# Altium schematic sheet PRINCIPAL.SchDoc: SENSACIONAL 2 - PRINCIPAL
size A3; ApprovedBy: ---; Author: MARIO DE MIGUEL; SheetNumber: 1; SheetTotal: 7; ProjectTitle: SENSACIONAL 2
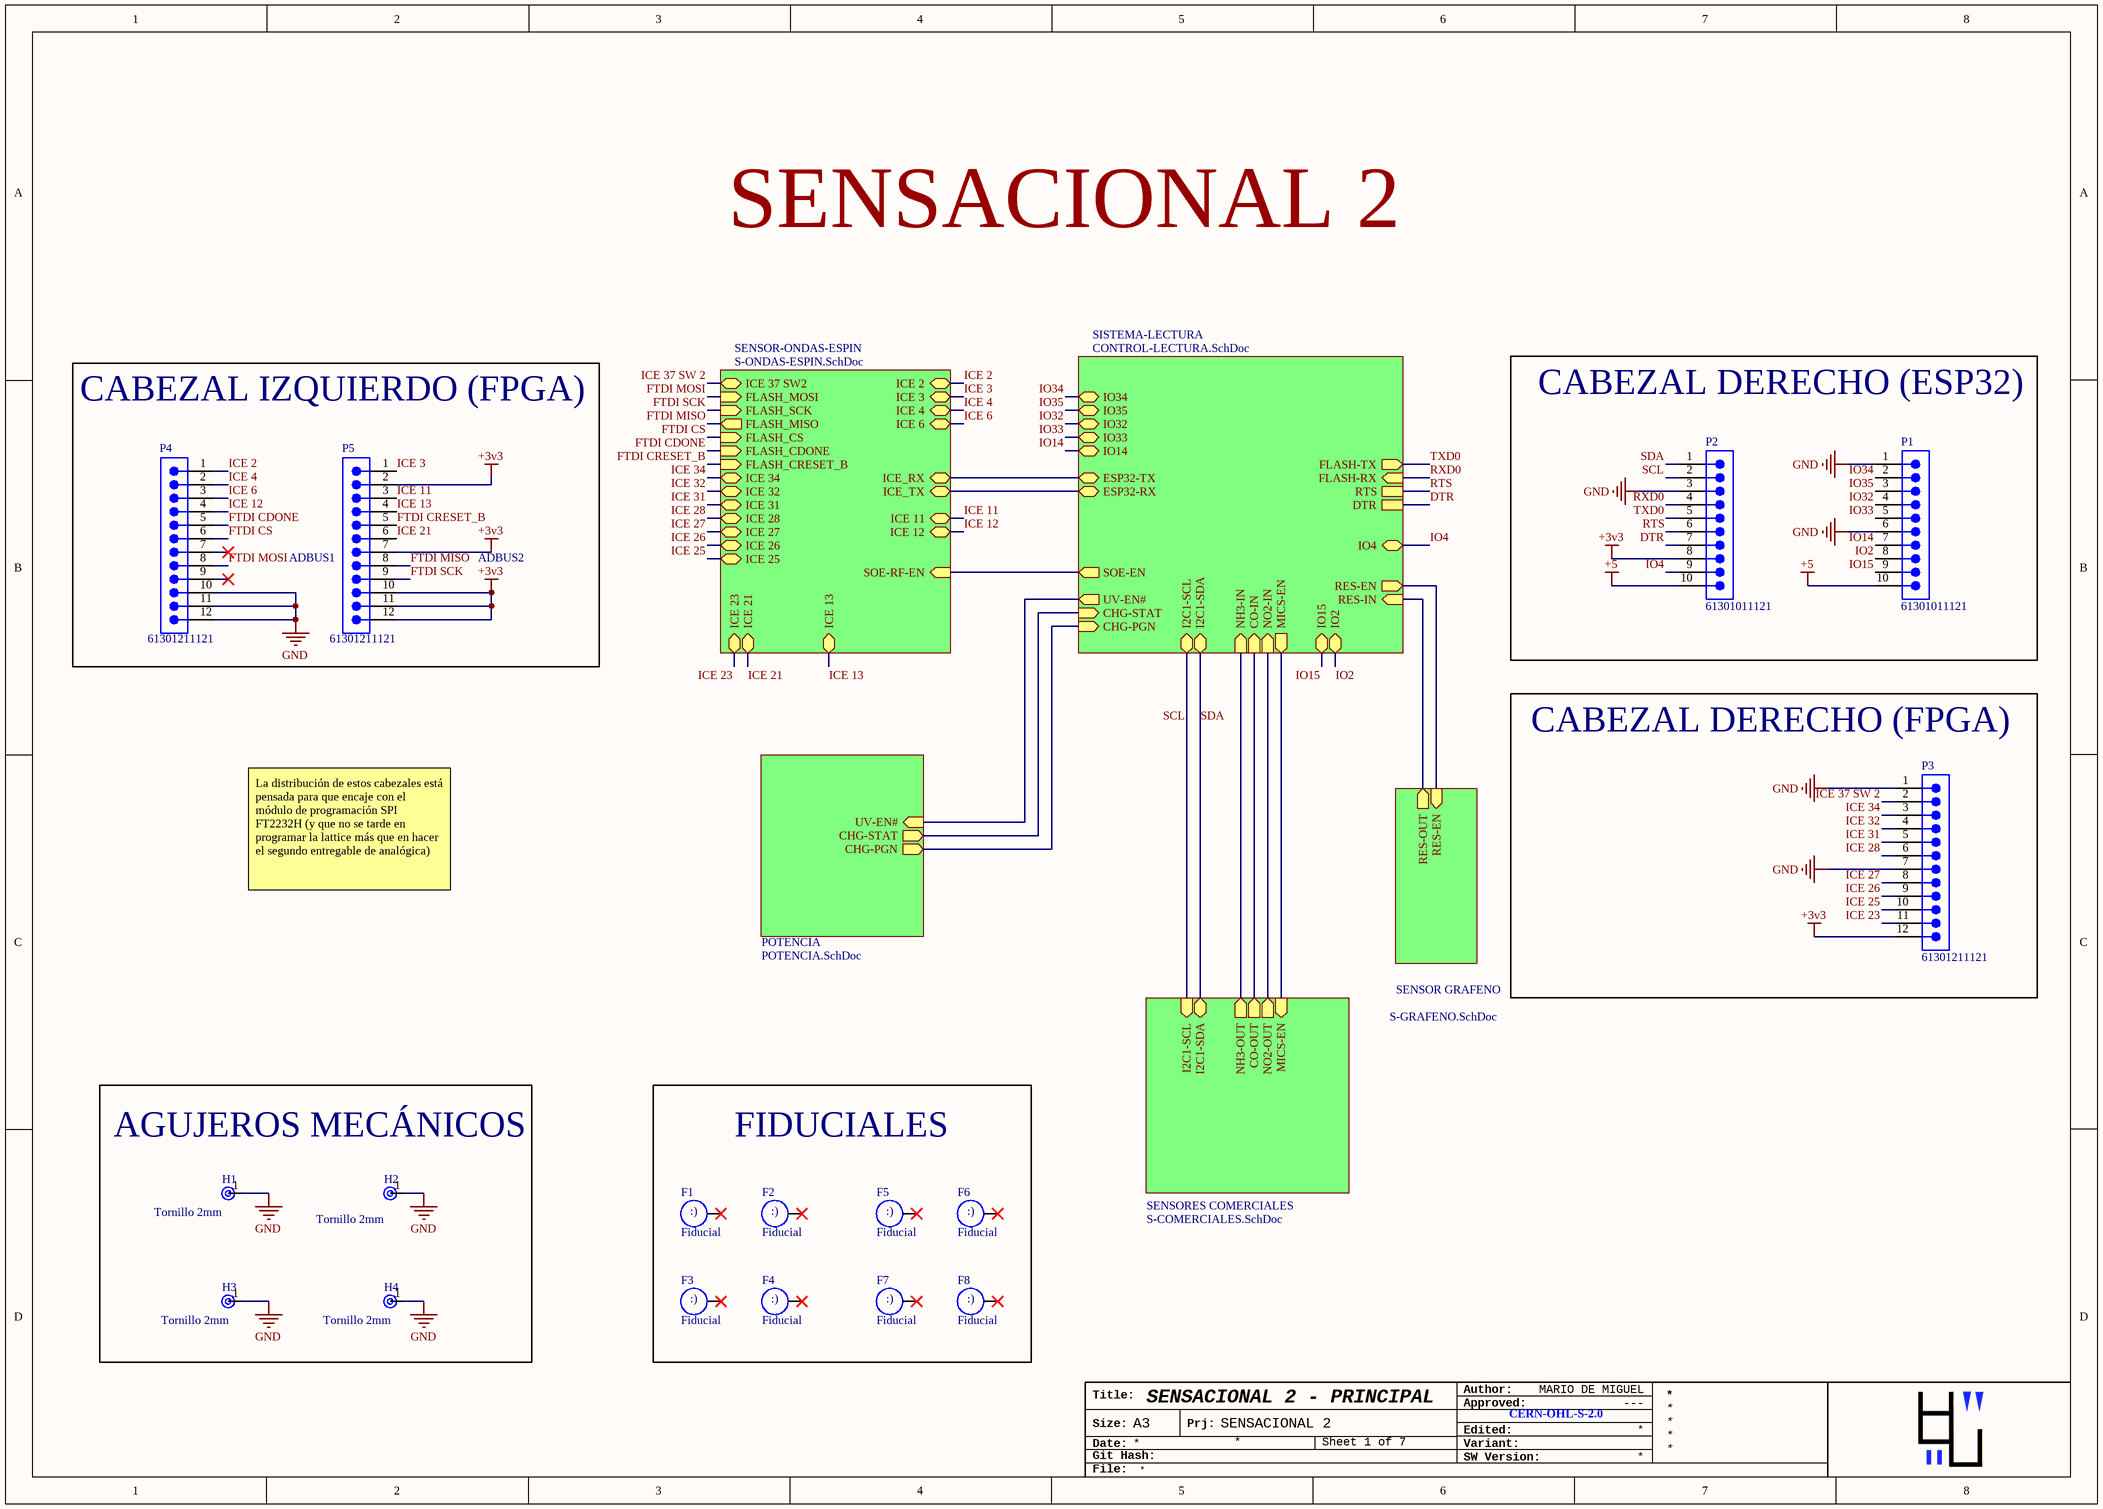
[diagram p0: PRINCIPAL.SchDoc]

## Parts
F1  Fiducial  [FIDUCIAL]  (no BOM)
F2  Fiducial  [FIDUCIAL]  (no BOM)
F3  Fiducial  [FIDUCIAL]  (no BOM)
F4  Fiducial  [FIDUCIAL]  (no BOM)
F5  Fiducial  [FIDUCIAL]  (no BOM)
F6  Fiducial  [FIDUCIAL]  (no BOM)
F7  Fiducial  [FIDUCIAL]  (no BOM)
F8  Fiducial  [FIDUCIAL]  (no BOM)
H1  Tornillo 2mm  [MOUNTING_HOLE]  (no BOM)
H2  Tornillo 2mm  [MOUNTING_HOLE]  (no BOM)
H3  Tornillo 2mm  [MOUNTING_HOLE]  (no BOM)
H4  Tornillo 2mm  [MOUNTING_HOLE]  (no BOM)
P1  61301011121  [61301011121]  (no BOM)
P2  61301011121  [61301011121]  (no BOM)
P3  61301211121  [61301211121]  (no BOM)
P4  61301211121  [61301211121]  (no BOM)
P5  61301211121  [61301211121]  (no BOM)

## Blocks framed on the sheet
CABEZAL IZQUIERDO (FPGA): P4 P5
CABEZAL DERECHO (ESP32): P1 P2
CABEZAL DERECHO (FPGA): P3
AGUJEROS MECÁNICOS: H1-H4
FIDUCIALES: F1-F8

## Sub-sheets
POTENCIA = POTENCIA.SchDoc: CHG-STAT (out), CHG-PGN (out), UV-EN# (in)
SENSOR GRAFENO = S-GRAFENO.SchDoc: RES-EN (in), RES-OUT (out)
SENSOR-ONDAS-ESPIN = S-ONDAS-ESPIN.SchDoc: ICE 2 (bidir), ICE 4 (bidir), ICE 3 (bidir), ICE 6 (bidir), ICE 11 (bidir), ICE 12 (bidir), ICE 21 (bidir), ICE 13 (bidir), ICE 37 SW2 (bidir), ICE 25 (bidir), ICE 23 (bidir), ICE 27 (bidir), ICE 26 (bidir), ICE 28 (bidir), ICE 31 (bidir), ICE 32 (bidir), ICE 34 (bidir), SOE-RF-EN (in), FLASH_MOSI (in), FLASH_SCK (in), FLASH_MISO (out), FLASH_CS (in), FLASH_CDONE (in), FLASH_CRESET_B (in), ICE_RX (bidir), ICE_TX (bidir)
SENSORES COMERCIALES = S-COMERCIALES.SchDoc: I2C1-SCL (in), I2C1-SDA (bidir), MICS-EN (in), NH3-OUT (out), CO-OUT (out), NO2-OUT (out)
SISTEMA-LECTURA = CONTROL-LECTURA.SchDoc: I2C1-SCL (bidir), I2C1-SDA (bidir), CHG-STAT (in), CHG-PGN (in), MICS-EN (out), RES-EN (out), UV-EN# (out), RES-IN (in), NH3-IN (in), CO-IN (in), NO2-IN (in), IO32 (bidir), IO33 (bidir), IO34 (bidir), IO35 (bidir), IO2 (bidir), IO4 (bidir), IO14 (bidir), IO15 (bidir), SOE-EN (out), FLASH-RX (in), FLASH-TX (out), RTS, DTR, ESP32-RX (bidir), ESP32-TX (bidir)

## Nets
+3v3: P2.8 P3.12 P5.2 P5.7 P5.10 P5.11 P5.12
+5: P1.10 P2.10
GND: H1.1(gnd) H2.1(gnd) H3.1(gnd) H4.1(gnd) P1.1 P1.6 P2.3 P3.1 P3.7 P4.10 P4.11 P4.12
DTR: P2.7 ; sheet SISTEMA-LECTURA/DTR
FTDI CDONE: P4.5 ; sheet SENSOR-ONDAS-ESPIN/FLASH_CDONE
FTDI CRESET_B: P5.5 ; sheet SENSOR-ONDAS-ESPIN/FLASH_CRESET_B
FTDI CS: P4.6 ; sheet SENSOR-ONDAS-ESPIN/FLASH_CS
FTDI MISO: P5.8 ; sheet SENSOR-ONDAS-ESPIN/FLASH_MISO
FTDI MOSI: P4.8 ; sheet SENSOR-ONDAS-ESPIN/FLASH_MOSI
FTDI SCK: P5.9 ; sheet SENSOR-ONDAS-ESPIN/FLASH_SCK
ICE 2: P4.1 ; sheet SENSOR-ONDAS-ESPIN/ICE 2
ICE 3: P5.1 ; sheet SENSOR-ONDAS-ESPIN/ICE 3
ICE 4: P4.2 ; sheet SENSOR-ONDAS-ESPIN/ICE 4
ICE 6: P4.3 ; sheet SENSOR-ONDAS-ESPIN/ICE 6
ICE 11: P5.3 ; sheet SENSOR-ONDAS-ESPIN/ICE 11
ICE 12: P4.4 ; sheet SENSOR-ONDAS-ESPIN/ICE 12
ICE 13: P5.4 ; sheet SENSOR-ONDAS-ESPIN/ICE 13
ICE 21: P5.6 ; sheet SENSOR-ONDAS-ESPIN/ICE 21
ICE 23: P3.11 ; sheet SENSOR-ONDAS-ESPIN/ICE 23
ICE 25: P3.10 ; sheet SENSOR-ONDAS-ESPIN/ICE 25
ICE 26: P3.9 ; sheet SENSOR-ONDAS-ESPIN/ICE 26
ICE 27: P3.8 ; sheet SENSOR-ONDAS-ESPIN/ICE 27
ICE 28: P3.6 ; sheet SENSOR-ONDAS-ESPIN/ICE 28
ICE 31: P3.5 ; sheet SENSOR-ONDAS-ESPIN/ICE 31
ICE 32: P3.4 ; sheet SENSOR-ONDAS-ESPIN/ICE 32
ICE 34: P3.3 ; sheet SENSOR-ONDAS-ESPIN/ICE 34
ICE 37 SW 2: P3.2 ; sheet SENSOR-ONDAS-ESPIN/ICE 37 SW2
IO2: P1.8 ; sheet SISTEMA-LECTURA/IO2
IO4: P2.9 ; sheet SISTEMA-LECTURA/IO4
IO14: P1.7 ; sheet SISTEMA-LECTURA/IO14
IO15: P1.9 ; sheet SISTEMA-LECTURA/IO15
IO32: P1.4 ; sheet SISTEMA-LECTURA/IO32
IO33: P1.5 ; sheet SISTEMA-LECTURA/IO33
IO34: P1.2 ; sheet SISTEMA-LECTURA/IO34
IO35: P1.3 ; sheet SISTEMA-LECTURA/IO35
RTS: P2.6 ; sheet SISTEMA-LECTURA/RTS
RXD0: P2.4 ; sheet SISTEMA-LECTURA/FLASH-RX
SCL: P2.2 ; sheet SENSORES COMERCIALES/I2C1-SCL, sheet SISTEMA-LECTURA/I2C1-SCL
SDA: P2.1 ; sheet SENSORES COMERCIALES/I2C1-SDA, sheet SISTEMA-LECTURA/I2C1-SDA
TXD0: P2.5 ; sheet SISTEMA-LECTURA/FLASH-TX
(unnamed): sheet POTENCIA/CHG-STAT, sheet SISTEMA-LECTURA/CHG-STAT
(unnamed): sheet POTENCIA/CHG-PGN, sheet SISTEMA-LECTURA/CHG-PGN
(unnamed): sheet POTENCIA/UV-EN#, sheet SISTEMA-LECTURA/UV-EN#
(unnamed): sheet SENSORES COMERCIALES/MICS-EN, sheet SISTEMA-LECTURA/MICS-EN
(unnamed): sheet SENSORES COMERCIALES/NH3-OUT, sheet SISTEMA-LECTURA/NH3-IN
(unnamed): sheet SENSORES COMERCIALES/CO-OUT, sheet SISTEMA-LECTURA/CO-IN
(unnamed): sheet SENSORES COMERCIALES/NO2-OUT, sheet SISTEMA-LECTURA/NO2-IN
(unnamed): sheet SENSOR GRAFENO/RES-EN, sheet SISTEMA-LECTURA/RES-EN
(unnamed): sheet SENSOR GRAFENO/RES-OUT, sheet SISTEMA-LECTURA/RES-IN
(unnamed): sheet SENSOR-ONDAS-ESPIN/SOE-RF-EN, sheet SISTEMA-LECTURA/SOE-EN
(unnamed): sheet SENSOR-ONDAS-ESPIN/ICE_RX, sheet SISTEMA-LECTURA/ESP32-TX
(unnamed): sheet SENSOR-ONDAS-ESPIN/ICE_TX, sheet SISTEMA-LECTURA/ESP32-RX

Not connected (* = marked no-connect by the designer): F1 1(NC)*; F2 1(NC)*; F3 1(NC)*; F4 1(NC)*; F5 1(NC)*; F6 1(NC)*; F7 1(NC)*; F8 1(NC)*; P4 7* 9*

## Notes on the sheet
- SENSACIONAL 2
- (near P5) ADBUS1
- ADBUS2
- La distribución de estos cabezales está pensada para que encaje con el módulo de programación SPI FT2232H (y que no se tarde en programar la lattice más que en hacer el segundo entregable de analógica)
- Title:
- Author:
- Approved:
- Size:
- Date:
- Git Hash:
- A3
- Prj:
- SW Version:
- Variant:
- Edited:
- CERN-OHL-S-2.0
- File:
- (in symbol Fiducial) :)

## Library data of the parts
H1-H4 = MountingHole
P1 P2 = CMP-1502-01082-5: NexarPartId: 18818159; Gender: Male; Number of Positions: 10; Operating Supply Voltage: 250V; Current Rating: 3A; Contact Resistance: 20mΩ; Connector Type: Male Pin; Insulation Resistance: 1GΩ; Pitch: 2.54mm; Color: Black; Contact Gender: Male; Height: 8.74mm; Orientation: Vertical; RoHS: Compliant; Packaging: Bulk; Min Operating Temperature: -40°C; Number of Pins: 10; Max Operating Temperature: 105°C; REACH SVHC: Unknown; Voltage Rating: 250V; Number of Rows: 1; Housing Material: PBT; Number of Contacts: 10; Mount: Through Hole; Contact Mating Length: 5.9944mm; Length: 2.54mm; Lead Pitch: 2.54mm; Flammability Rating: UL94 V-0; Termination: Solder; Contact Material: Copper; Width: 25.4mm; Contact Plating: Gold
P3-P5 = CMP-1502-01086-3: NexarPartId: 32855538; Contact Resistance: 20mΩ; Current Rating: 3A; Operating Supply Voltage: 250V; Number of Positions: 12; Connector Type: Male Pin; Gender: Male; Pitch: 2.54mm; Number of Pins: 12; Mount: Through Hole; Color: Black; RoHS: Compliant; Contact Plating: Gold; Contact Material: Copper; Packaging: Bulk; Orientation: Vertical; Number of Contacts: 12; Termination: Solder; Contact Mating Length: 5.9944mm; Lead Pitch: 2.54mm; REACH SVHC: Unknown; Number of Rows: 1